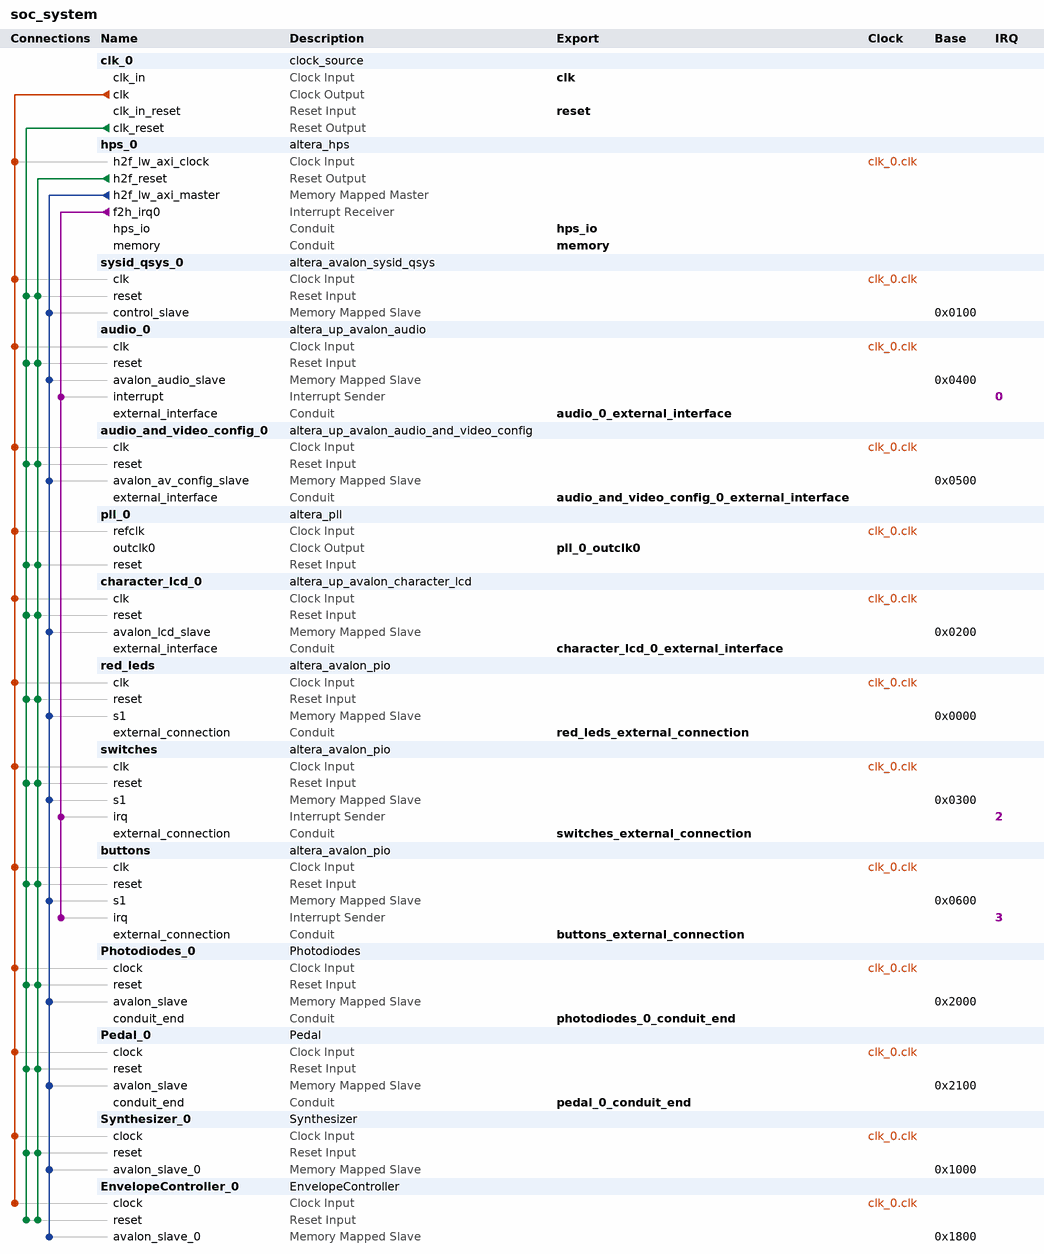
[diagram p0: system contents]
# Platform Designer (Qsys) system soc_system, Cyclone V 5CSEMA5F31C6
# Parameters at their usual value, and those the tool derives, are not listed.
package require -exact qsys 17.0
create_system soc_system
set_project_property DEVICE_FAMILY {Cyclone V}
set_project_property DEVICE 5CSEMA5F31C6

add_instance clk_0 clock_source 17.0
set_instance_parameter_value clk_0 clockFrequency 50000000

add_instance hps_0 altera_hps 17.0
set_instance_parameter_value hps_0 EMAC1_Mode RGMII
set_instance_parameter_value hps_0 EMAC1_PinMuxing {HPS I/O Set 0}
set_instance_parameter_value hps_0 F2SCLK_COLDRST_Enable false
set_instance_parameter_value hps_0 F2SCLK_DBGRST_Enable false
set_instance_parameter_value hps_0 F2SCLK_WARMRST_Enable false
set_instance_parameter_value hps_0 F2SINTERRUPT_Enable true
set_instance_parameter_value hps_0 F2S_Width 0
set_instance_parameter_value hps_0 FPGA_PERIPHERAL_OUTPUT_CLOCK_FREQ_EMAC0_GTX_CLK 125
set_instance_parameter_value hps_0 FPGA_PERIPHERAL_OUTPUT_CLOCK_FREQ_EMAC0_MD_CLK 2.5
set_instance_parameter_value hps_0 FPGA_PERIPHERAL_OUTPUT_CLOCK_FREQ_EMAC1_GTX_CLK 125
set_instance_parameter_value hps_0 FPGA_PERIPHERAL_OUTPUT_CLOCK_FREQ_EMAC1_MD_CLK 2.5
set_instance_parameter_value hps_0 HPS_PROTOCOL DDR3
set_instance_parameter_value hps_0 I2C0_Mode I2C
set_instance_parameter_value hps_0 I2C0_PinMuxing {HPS I/O Set 0}
set_instance_parameter_value hps_0 I2C1_Mode I2C
set_instance_parameter_value hps_0 I2C1_PinMuxing {HPS I/O Set 0}
set_instance_parameter_value hps_0 LWH2F_Enable true
set_instance_parameter_value hps_0 MEM_BANKADDR_WIDTH 3
set_instance_parameter_value hps_0 MEM_CLK_FREQ 400.0
set_instance_parameter_value hps_0 MEM_COL_ADDR_WIDTH 10
set_instance_parameter_value hps_0 MEM_DQ_WIDTH 32
set_instance_parameter_value hps_0 MEM_DRV_STR RZQ/7
set_instance_parameter_value hps_0 MEM_ROW_ADDR_WIDTH 15
set_instance_parameter_value hps_0 MEM_RTT_NOM RZQ/4
set_instance_parameter_value hps_0 MEM_RTT_WR RZQ/4
set_instance_parameter_value hps_0 MEM_TCL 11
set_instance_parameter_value hps_0 MEM_TFAW_NS 30.0
set_instance_parameter_value hps_0 MEM_TRAS_NS 35.0
set_instance_parameter_value hps_0 MEM_TRCD_NS 13.75
set_instance_parameter_value hps_0 MEM_TRFC_NS 260.0
set_instance_parameter_value hps_0 MEM_TRP_NS 13.75
set_instance_parameter_value hps_0 MEM_VENDOR Other
set_instance_parameter_value hps_0 MEM_WTCL 8
set_instance_parameter_value hps_0 QSPI_Mode N/A
set_instance_parameter_value hps_0 QSPI_PinMuxing Unused
set_instance_parameter_value hps_0 REF_CLK_FREQ 25.0
set_instance_parameter_value hps_0 S2FCLK_USER2CLK 5
set_instance_parameter_value hps_0 S2F_Width 0
set_instance_parameter_value hps_0 SDIO_Mode {4-bit Data}
set_instance_parameter_value hps_0 SDIO_PinMuxing {HPS I/O Set 0}
set_instance_parameter_value hps_0 SPIM1_Mode {Single Slave Select}
set_instance_parameter_value hps_0 SPIM1_PinMuxing {HPS I/O Set 0}
set_instance_parameter_value hps_0 STM_Enable false
set_instance_parameter_value hps_0 TIMING_BOARD_AC_SKEW 0.02
set_instance_parameter_value hps_0 TIMING_BOARD_AC_TO_CK_SKEW 0.01
set_instance_parameter_value hps_0 TIMING_BOARD_DQ_TO_DQS_SKEW 0.05
set_instance_parameter_value hps_0 TIMING_BOARD_MAX_CK_DELAY 0.03
set_instance_parameter_value hps_0 TIMING_BOARD_MAX_DQS_DELAY 0.02
set_instance_parameter_value hps_0 TIMING_BOARD_SKEW_BETWEEN_DQS 0.06
set_instance_parameter_value hps_0 TIMING_BOARD_SKEW_CKDQS_DIMM_MAX 0.12
set_instance_parameter_value hps_0 TIMING_BOARD_SKEW_CKDQS_DIMM_MIN 0.06
set_instance_parameter_value hps_0 TIMING_BOARD_SKEW_WITHIN_DQS 0.01
set_instance_parameter_value hps_0 TIMING_TDH 65
set_instance_parameter_value hps_0 TIMING_TDQSCK 255
set_instance_parameter_value hps_0 TIMING_TDQSQ 125
set_instance_parameter_value hps_0 TIMING_TDS 30
set_instance_parameter_value hps_0 TIMING_TIH 140
set_instance_parameter_value hps_0 TIMING_TIS 180
set_instance_parameter_value hps_0 TIMING_TQSH 0.4
set_instance_parameter_value hps_0 UART0_Mode {No Flow Control}
set_instance_parameter_value hps_0 UART0_PinMuxing {HPS I/O Set 0}
set_instance_parameter_value hps_0 USB1_Mode SDR
set_instance_parameter_value hps_0 USB1_PinMuxing {HPS I/O Set 0}
set_instance_parameter_value hps_0 desired_cfg_clk_mhz 100.0
set_instance_parameter_value hps_0 desired_qspi_clk_mhz 400.0
set_instance_parameter_value hps_0 use_default_mpu_clk false

add_instance sysid_qsys_0 altera_avalon_sysid_qsys 17.0
set_instance_parameter_value sysid_qsys_0 id 0

add_instance audio_0 altera_up_avalon_audio 17.0
set_instance_parameter_value audio_0 audio_in true
set_instance_parameter_value audio_0 avalon_bus_type {Memory Mapped}
set_instance_parameter_value audio_0 dw 16

add_instance audio_and_video_config_0 altera_up_avalon_audio_and_video_config 17.0
set_instance_parameter_value audio_and_video_config_0 audio_in {Microphone to ADC}
set_instance_parameter_value audio_and_video_config_0 bit_length 16
set_instance_parameter_value audio_and_video_config_0 board DE1-SoC
set_instance_parameter_value audio_and_video_config_0 eai false
set_instance_parameter_value audio_and_video_config_0 line_in_bypass false
set_instance_parameter_value audio_and_video_config_0 sampling_rate {32 kHz}

add_instance pll_0 altera_pll 17.0
set_instance_parameter_value pll_0 gui_device_speed_grade 1
set_instance_parameter_value pll_0 gui_number_of_clocks 1
set_instance_parameter_value pll_0 gui_operation_mode direct
set_instance_parameter_value pll_0 gui_output_clock_frequency0 11.2896
set_instance_parameter_value pll_0 gui_pll_mode {Fractional-N PLL}
set_instance_parameter_value pll_0 gui_reference_clock_frequency 50.0
set_instance_parameter_value pll_0 gui_use_locked false

add_instance character_lcd_0 altera_up_avalon_character_lcd 17.0
set_instance_parameter_value character_lcd_0 cursor Normal

add_instance red_leds altera_avalon_pio 17.0
set_instance_parameter_value red_leds direction Output
set_instance_parameter_value red_leds width 10

add_instance switches altera_avalon_pio 17.0
set_instance_parameter_value switches captureEdge true
set_instance_parameter_value switches direction Input
set_instance_parameter_value switches edgeType ANY
set_instance_parameter_value switches generateIRQ true
set_instance_parameter_value switches irqType EDGE
set_instance_parameter_value switches width 10

add_instance buttons altera_avalon_pio 17.0
set_instance_parameter_value buttons captureEdge true
set_instance_parameter_value buttons direction Input
set_instance_parameter_value buttons edgeType FALLING
set_instance_parameter_value buttons generateIRQ true
set_instance_parameter_value buttons width 4

add_instance Photodiodes_0 Photodiodes 1.0

add_instance Pedal_0 Pedal 1.0

add_instance Synthesizer_0 Synthesizer 1.0

add_instance EnvelopeController_0 EnvelopeController 1.0

# connections
add_connection clk_0.clk audio_0.clk clock
add_connection clk_0.clk audio_and_video_config_0.clk clock
add_connection clk_0.clk buttons.clk clock
add_connection clk_0.clk character_lcd_0.clk clock
add_connection clk_0.clk EnvelopeController_0.clock clock
add_connection clk_0.clk hps_0.h2f_lw_axi_clock clock
add_connection clk_0.clk Pedal_0.clock clock
add_connection clk_0.clk Photodiodes_0.clock clock
add_connection clk_0.clk pll_0.refclk clock
add_connection clk_0.clk red_leds.clk clock
add_connection clk_0.clk switches.clk clock
add_connection clk_0.clk Synthesizer_0.clock clock
add_connection clk_0.clk sysid_qsys_0.clk clock
add_connection clk_0.clk_reset audio_0.reset reset
add_connection clk_0.clk_reset audio_and_video_config_0.reset reset
add_connection clk_0.clk_reset buttons.reset reset
add_connection clk_0.clk_reset character_lcd_0.reset reset
add_connection clk_0.clk_reset EnvelopeController_0.reset reset
add_connection clk_0.clk_reset Pedal_0.reset reset
add_connection clk_0.clk_reset Photodiodes_0.reset reset
add_connection clk_0.clk_reset pll_0.reset reset
add_connection clk_0.clk_reset red_leds.reset reset
add_connection clk_0.clk_reset switches.reset reset
add_connection clk_0.clk_reset Synthesizer_0.reset reset
add_connection clk_0.clk_reset sysid_qsys_0.reset reset
add_connection hps_0.h2f_reset audio_0.reset reset
add_connection hps_0.h2f_reset audio_and_video_config_0.reset reset
add_connection hps_0.h2f_reset buttons.reset reset
add_connection hps_0.h2f_reset character_lcd_0.reset reset
add_connection hps_0.h2f_reset EnvelopeController_0.reset reset
add_connection hps_0.h2f_reset Pedal_0.reset reset
add_connection hps_0.h2f_reset Photodiodes_0.reset reset
add_connection hps_0.h2f_reset pll_0.reset reset
add_connection hps_0.h2f_reset red_leds.reset reset
add_connection hps_0.h2f_reset switches.reset reset
add_connection hps_0.h2f_reset Synthesizer_0.reset reset
add_connection hps_0.h2f_reset sysid_qsys_0.reset reset
add_connection hps_0.h2f_lw_axi_master audio_0.avalon_audio_slave avalon
set_connection_parameter_value hps_0.h2f_lw_axi_master/audio_0.avalon_audio_slave baseAddress 0x0400
add_connection hps_0.h2f_lw_axi_master audio_and_video_config_0.avalon_av_config_slave avalon
set_connection_parameter_value hps_0.h2f_lw_axi_master/audio_and_video_config_0.avalon_av_config_slave baseAddress 0x0500
add_connection hps_0.h2f_lw_axi_master buttons.s1 avalon
set_connection_parameter_value hps_0.h2f_lw_axi_master/buttons.s1 baseAddress 0x0600
add_connection hps_0.h2f_lw_axi_master character_lcd_0.avalon_lcd_slave avalon
set_connection_parameter_value hps_0.h2f_lw_axi_master/character_lcd_0.avalon_lcd_slave baseAddress 0x0200
add_connection hps_0.h2f_lw_axi_master EnvelopeController_0.avalon_slave_0 avalon
set_connection_parameter_value hps_0.h2f_lw_axi_master/EnvelopeController_0.avalon_slave_0 baseAddress 0x1800
add_connection hps_0.h2f_lw_axi_master Pedal_0.avalon_slave avalon
set_connection_parameter_value hps_0.h2f_lw_axi_master/Pedal_0.avalon_slave baseAddress 0x2100
add_connection hps_0.h2f_lw_axi_master Photodiodes_0.avalon_slave avalon
set_connection_parameter_value hps_0.h2f_lw_axi_master/Photodiodes_0.avalon_slave baseAddress 0x2000
add_connection hps_0.h2f_lw_axi_master red_leds.s1 avalon
set_connection_parameter_value hps_0.h2f_lw_axi_master/red_leds.s1 baseAddress 0x0000
add_connection hps_0.h2f_lw_axi_master switches.s1 avalon
set_connection_parameter_value hps_0.h2f_lw_axi_master/switches.s1 baseAddress 0x0300
add_connection hps_0.h2f_lw_axi_master Synthesizer_0.avalon_slave_0 avalon
set_connection_parameter_value hps_0.h2f_lw_axi_master/Synthesizer_0.avalon_slave_0 baseAddress 0x1000
add_connection hps_0.h2f_lw_axi_master sysid_qsys_0.control_slave avalon
set_connection_parameter_value hps_0.h2f_lw_axi_master/sysid_qsys_0.control_slave baseAddress 0x0100
add_connection hps_0.f2h_irq0 audio_0.interrupt interrupt
set_connection_parameter_value hps_0.f2h_irq0/audio_0.interrupt irqNumber 0
add_connection hps_0.f2h_irq0 buttons.irq interrupt
set_connection_parameter_value hps_0.f2h_irq0/buttons.irq irqNumber 3
add_connection hps_0.f2h_irq0 switches.irq interrupt
set_connection_parameter_value hps_0.f2h_irq0/switches.irq irqNumber 2

# exported interfaces
add_interface audio_0_external_interface conduit end
set_interface_property audio_0_external_interface EXPORT_OF audio_0.external_interface
add_interface audio_and_video_config_0_external_interface conduit end
set_interface_property audio_and_video_config_0_external_interface EXPORT_OF audio_and_video_config_0.external_interface
add_interface buttons_external_connection conduit end
set_interface_property buttons_external_connection EXPORT_OF buttons.external_connection
add_interface character_lcd_0_external_interface conduit end
set_interface_property character_lcd_0_external_interface EXPORT_OF character_lcd_0.external_interface
add_interface clk clock sink
set_interface_property clk EXPORT_OF clk_0.clk_in
add_interface hps_io conduit end
set_interface_property hps_io EXPORT_OF hps_0.hps_io
add_interface memory conduit end
set_interface_property memory EXPORT_OF hps_0.memory
add_interface pedal_0_conduit_end conduit end
set_interface_property pedal_0_conduit_end EXPORT_OF Pedal_0.conduit_end
add_interface photodiodes_0_conduit_end conduit end
set_interface_property photodiodes_0_conduit_end EXPORT_OF Photodiodes_0.conduit_end
add_interface pll_0_outclk0 clock source
set_interface_property pll_0_outclk0 EXPORT_OF pll_0.outclk0
add_interface red_leds_external_connection conduit end
set_interface_property red_leds_external_connection EXPORT_OF red_leds.external_connection
add_interface reset reset sink
set_interface_property reset EXPORT_OF clk_0.clk_in_reset
add_interface switches_external_connection conduit end
set_interface_property switches_external_connection EXPORT_OF switches.external_connection

set_interconnect_requirement {$system} qsys_mm.clockCrossingAdapter HANDSHAKE
set_interconnect_requirement {$system} qsys_mm.enableEccProtection FALSE
set_interconnect_requirement {$system} qsys_mm.insertDefaultSlave FALSE
set_interconnect_requirement {$system} qsys_mm.maxAdditionalLatency 1

save_system soc_system.qsys
